# EAGLE design tiny84 (EAGLE 5.12)
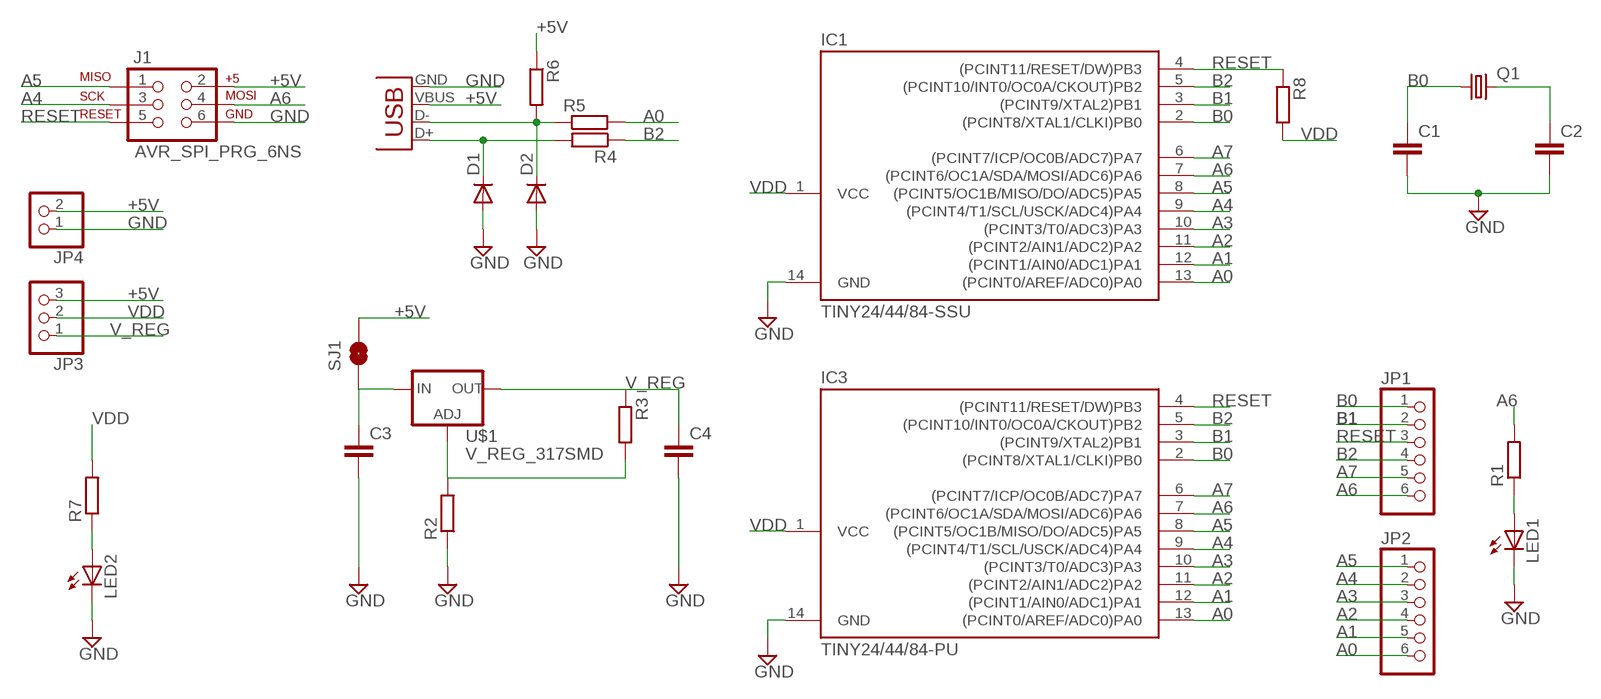
[diagram p0: schematic, sheet 1]

## Parts
C1  C-EU025-025X050  [C025-025X050]
C2  C-EU025-025X050  [C025-025X050]
C3  C-EUC0603  [C0603]
C4  C-EUC0603  [C0603]
D1  DIODE-MICROMELF-W  [MICROMELF-W]
D2  DIODE-MICROMELF-W  [MICROMELF-W]
IC1  TINY24/44/84-SSU  [SOIC14]
IC3  TINY24/44/84-PU  [DIL14]
J1  AVR_SPI_PRG_6NS  [2X3-NS]
JP1  PINHD-1X6  [1X06]
JP2  PINHD-1X6  [1X06]
JP3  PINHD-1X3  [1X03]
JP4  PINHD-1X2  [1X02]
LED1  LEDCHIP-LED0805  [CHIP-LED0805]
LED2  LEDCHIP-LED0805  [CHIP-LED0805]
Q1  CRYSTALHC49UV  [HC49U-V]
R1  R-EU_R0805  [R0805]
R2  R-EU_R0603  [R0603]
R3  R-EU_R0603  [R0603]
R4  R-EU_0204/5  [0204/5]
R5  R-EU_0204/5  [0204/5]
R6  R-EU_0204/5  [0204/5]
R7  R-EU_R0805  [R0805]
R8  R-EU_R0805  [R0805]
SJ1  SOLDERJUMPERNC  [SJ_2S]
U$1  V_REG_317SMD  [SOT223]
X1  USBOLD  [USB-MINIB-OLD]

## Nets
+5V: J1.2 JP3.3 JP4.2 R6.1 SJ1.2 X1.VBUS
A0: IC1.13((PCINT0/AREF/ADC0)PA0) IC3.13((PCINT0/AREF/ADC0)PA0) JP2.6 R5.2
A1: IC1.12((PCINT1/AIN0/ADC1)PA1) IC3.12((PCINT1/AIN0/ADC1)PA1) JP2.5
A2: IC1.11((PCINT2/AIN1/ADC2)PA2) IC3.11((PCINT2/AIN1/ADC2)PA2) JP2.4
A3: IC1.10((PCINT3/T0/ADC3)PA3) IC3.10((PCINT3/T0/ADC3)PA3) JP2.3
A4: IC1.9((PCINT4/T1/SCL/USCK/ADC4)PA4) IC3.9((PCINT4/T1/SCL/USCK/ADC4)PA4) J1.3 JP2.2
A5: IC1.8((PCINT5/OC1B/MISO/DO/ADC5)PA5) IC3.8((PCINT5/OC1B/MISO/DO/ADC5)PA5) J1.1 JP2.1
A6: IC1.7((PCINT6/OC1A/SDA/MOSI/ADC6)PA6) IC3.7((PCINT6/OC1A/SDA/MOSI/ADC6)PA6) J1.4 JP1.6 R1.2
A7: IC1.6((PCINT7/ICP/OC0B/ADC7)PA7) IC3.6((PCINT7/ICP/OC0B/ADC7)PA7) JP1.5
B0: C1.1 IC1.2((PCINT8/XTAL1/CLKI)PB0) IC3.2((PCINT8/XTAL1/CLKI)PB0) JP1.1 Q1.1
B1: C2.1 IC1.3((PCINT9/XTAL2)PB1) IC3.3((PCINT9/XTAL2)PB1) JP1.2 Q1.2
B2: IC1.5((PCINT10/INT0/OC0A/CKOUT)PB2) IC3.5((PCINT10/INT0/OC0A/CKOUT)PB2) JP1.4 R4.1
GND: C1.2 C2.2 C3.2 C4.2 D1.A D2.A IC1.14(GND) IC3.14(GND) J1.6 JP4.1 LED1.C LED2.C R2.1 X1.GND
N$1: LED1.A R1.1
N$2: D1.C R4.2 X1.D+
N$3: R2.2 R3.2 U$1.1(ADJ)
N$5: D2.C R5.1 R6.2 X1.D-
N$6: C3.1 SJ1.1 U$1.3(IN)
N$8: LED2.A R7.1
RESET: IC1.4((PCINT11/RESET/DW)PB3) IC3.4((PCINT11/RESET/DW)PB3) J1.5 JP1.3 R8.1
V_REG: C4.1 JP3.1 R3.1 U$1.2(OUT)
VDD: IC1.1(VCC) IC3.1(VCC) JP3.2 R7.2 R8.2

## Library data of the parts
C1-C4 = rcl:C-EU: CAPACITOR, European symbol
D1 D2 = diode:DIODE-: DIODE
IC1 IC3 = avr-6:TINY24/44/84
J1 = SparkFun_ihsan:AVR_SPI_PRG_6: AVR ISP 6 Pin This is the reduced ISP connector for AVR programming. Common on Arduino. This footprint will take up less PCB space and can be used with a 10-pin to 6-pin adapter such as SKU: BOB-08508
JP1 JP2 = pinhead:PINHD-1X6: PIN HEADER
JP3 = pinhead:PINHD-1X3: PIN HEADER
JP4 = pinhead:PINHD-1X2: PIN HEADER
LED1 LED2 = adafruit:LED: LED OSRAM: - CHIPLED LG R971, LG N971, LY N971, LG Q971, LY Q971, LO R971, LY R971 LH N974, LH R974 LS Q976, LO Q976, LY Q976 LO Q996 - Hyper CHIPLED LW Q18S LB Q993, LB Q99A, LB R99A - SideLED LS A670, LO A670, LY A670, LG A670, LP A670 LB A673, LV A673, LT A673, LW A673 LH A674 LY A675 LS A676, LA A676, LO A676, LY A676, LW A676 LS A679, LY A679, LG A679 - Hyper Micro SIDELED® LS Y876, LA Y876, LO Y876, LY Y876 LT Y87S - SmartLED LW L88C, LW L88S LB L89C, LB L89S, LG L890 LS L89K, LO L89K, LY L89K LS L896, LA L896, LO L896, LY L896 - TOPLED LS T670, LO T670, LY T670, LG T670, LP T670 LSG T670, LSP T670, LSY T670, LOP T670, LYG T670 LG T671, LOG T671, LSG T671 LB T673, LV T673, LT T673, LW T673 LH T674 LS T676, LA T676, LO T676, LY T676, LB T676, LH T676, LSB T676, LW T676 LB T67C, LV T67C, LT T67C, LS T67K, LO T67K, LY T67K, LW E67C LS E67B, LA E67B, LO E67B, LY E67B, LB E67C, LV E67C, LT E67C LW T67C LS T679, LY T679, LG T679 LS T770, LO T770, LY T770, LG T770, LP T770 LB T773, LV T773, LT T773, LW T773 LH T774 LS E675, LA E675, LY E675, LS T675 LS T776, LA T776, LO T776, LY T776, LB T776 LHGB T686 LT T68C, LB T68C - Hyper Mini TOPLED® LB M676 - Mini TOPLED Santana® LG M470 LS M47K, LO M47K, LY M47K Source: http://www.osram.convergy.de/
Q1 = SparkFun_ihsan:CRYSTAL: Crystals Various standard crystals. Proven footprints. Spark Fun Electronics SKU : COM-00534
R1-R8 = rcl:R-EU_: RESISTOR, European symbol
SJ1 = SparkFun_ihsan:SOLDERJUMPER: Solder Jumper Standard SMD solder jumper. Used to automate production. Two varients : Normally Open and Normally Closed are the same, but have different paste layers. NC will have a large amount of paste and should jumper during reflow.
U$1 = SparkFun_ihsan:V_REG_317: Voltage Regulator Standard LM317 adjustable voltage regulator. AOI (Adjust Output Input). Google 'LM317 Calculator' for easy to use app to get the two resistor values needed. 240/720 for 5V output. 240/390 for 3.3V output. Spark Fun Electronics SKU : COM-00527
X1 = SparkFun_ihsan:USB: USB Connectors USB-B-PTH is fully proven SKU : PRT-00139 USB-miniB is fully proven SKU : PRT-00587 USB-A-PCB is untested. USB-A-H is throughly reviewed, but untested. Spark Fun Electronics SKU : PRT-00437 USB-B-SMT is throughly reviewed, but untested. Needs silkscreen touching up. USB-A-S has not been used/tested USB-MB-H has not been used/tested

## Board
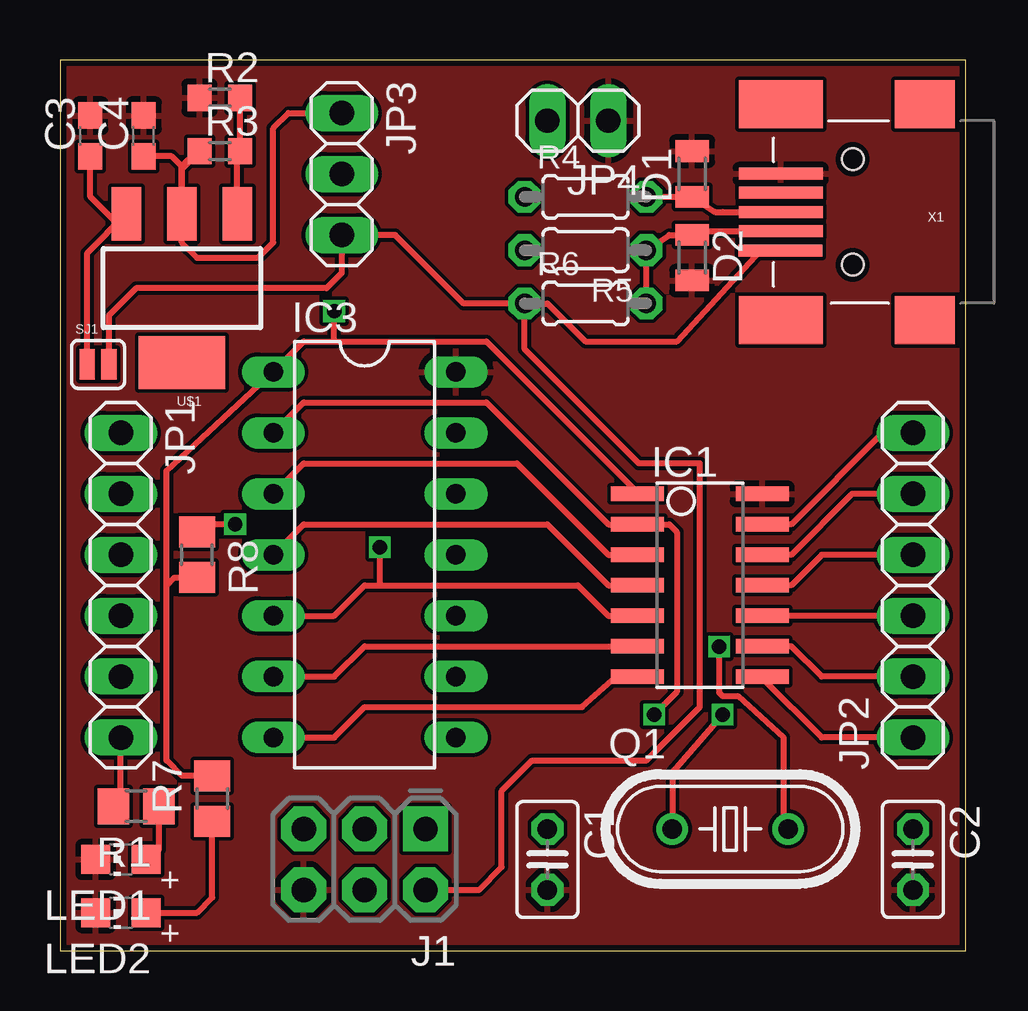
[diagram p1: board, top side]
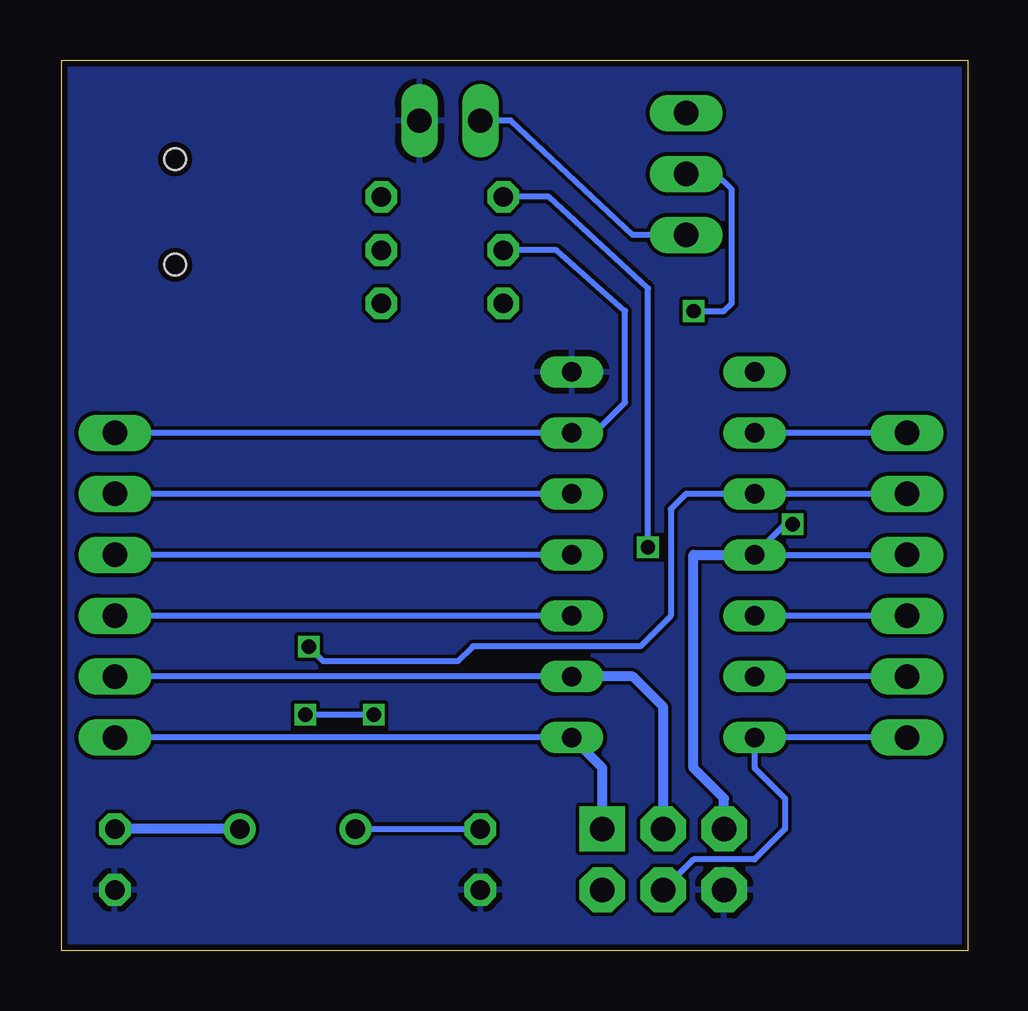
[diagram p2: board, bottom side, seen from below]

Size 37.77 x 37.14 mm. Coordinates in mm from the lower left corner, seen from the top.
Outline: 0,0 37.77,0 37.77,37.14 0,37.14 0,0
Copper layers (1*16): Top 0.035mm / dielectric 1.5mm / Bottom 0.035mm
Design rules "Fusion_eagle_rule_v1.1": minimum track width 6mil, minimum drill 12mil, track to track 6mil, track to pad 6mil, pad to pad 6mil, via to via 6mil, smd to smd 0mil, copper to edge 10mil, drill to drill 10mil, minimum pad ring 10mil, minimum via ring 6mil, stop-mask expansion 2mil, vias tented up to drill 100mil, thermal gap 10mil

### Footprints (pad centres in the part's own frame; a part is rotated, then mirrored left to right if it is on the bottom)
C025-025X050 = drill 0.813 octagon: 1 -1.27,0; 2 1.27,0
C0603 = smd 1.1 x 1: 1 -0.85,0; 2 0.85,0
MICROMELF-W = smd 0.9 x 1.4: A 0.95,0; C -0.95,0
SOIC14 = smd 0.61 x 2.21: 1 -3.81,-2.603; 2 -2.54,-2.603; 3 -1.27,-2.603; 4 0,-2.603; 5 1.27,-2.603; 6 2.54,-2.603; 7 3.81,-2.603; 8 3.81,2.603; 9 2.54,2.603; 10 1.27,2.603; 11 0,2.603; 12 -1.27,2.603; 13 -2.54,2.603; 14 -3.81,2.603
DIL14 = drill 0.813 long: 1 -7.62,-3.81; 2 -5.08,-3.81; 3 -2.54,-3.81; 4 0,-3.81; 5 2.54,-3.81; 6 5.08,-3.81; 7 7.62,-3.81; 8 7.62,3.81; 9 5.08,3.81; 10 2.54,3.81; 11 0,3.81; 12 -2.54,3.81; 13 -5.08,3.81; 14 -7.62,3.81
2X3-NS = drill 1.016 pad 1.88 square: 1 -2.54,-1.27 | drill 1.016 pad 1.88 octagon: 2 -2.54,1.27; 3 0,-1.27; 4 0,1.27; 5 2.54,-1.27; 6 2.54,1.27
1X06 = drill 1.016 long: 1 -6.35,0; 2 -3.81,0; 3 -1.27,0; 4 1.27,0; 5 3.81,0; 6 6.35,0
1X03 = drill 1.016 long: 1 -2.54,0; 2 0,0; 3 2.54,0
1X02 = drill 1.016 long: 1 -1.27,0; 2 1.27,0
CHIP-LED0805 = smd 1.2 x 1.2: A 0,-1.05; C 0,1.05
HC49U-V = drill 0.813 round: 1 -2.413,0; 2 2.413,0
R0805 = smd 1.3 x 1.5: 1 -0.95,0; 2 0.95,0
R0603 = smd 1 x 1.1: 1 -0.85,0; 2 0.85,0
0204/5 = drill 0.813 octagon: 1 -2.54,0; 2 2.54,0
SJ_2S = smd 0.635 x 1.27: 1 -0.45,0; 2 0.45,0
SOT223 = smd 1.219 x 2.235: 1 -2.311,-3.099; 2 0,-3.099; 3 2.311,-3.099 | smd 3.6 x 2.2: 4 0,3.099
USB-MINIB-OLD = smd 2.5 x 2: 1 -3,-4.5; 2 -3,4.5 | smd 3.5 x 2: 3 3,-4.5; 4 3,4.5 | smd 3.5 x 0.5: D+ 3,0; D- 3,0.8; GND 3,-1.6; ID 3,-0.8; VBUS 3.01,1.61 | hole 0.9: 0,2.2; 0,-2.2

### Placement (x,y rotation side)
C1  20.32,3.81 270 top
C2  35.56,3.81 270 top
C3  1.27,33.97 90 top
C4  3.49,33.97 90 top
D1  26.35,32.38 90 top
D2  26.35,28.89 270 top
IC1  26.67,15.24 270 top
IC3  12.7,16.51 270 top
J1  12.7,3.81 180 top
JP1  2.54,15.24 270 top
JP2  35.56,15.24 90 top
JP3  11.75,32.38 270 top
JP4  21.59,34.61 180 top
LED1  2.54,3.81 90 top
LED2  2.54,1.59 90 top
Q1  27.94,5.08 0 top
R1  3.17,6.03 180 top
R2  6.67,35.56 0 top
R3  6.67,33.34 0 top
R4  21.91,31.43 0 top
R5  21.91,29.21 180 top
R6  21.91,26.99 0 top
R7  6.35,6.35 90 top
R8  5.71,16.51 270 top
SJ1  1.59,24.45 0 top
U$1  5.08,27.62 180 top
X1  33.05,30.8 180 top

### Tracks (layer width: path | path; a pad name or v marks a point on that pad's centre or on a via)
+5V
  Top 0.254: J1.2 17.46,2.54 18.41,3.49 18.41,6.67 19.68,7.94 24.45,7.94 26.67,10.16 26.67,20.32 24.13,20.32 20,24.45 19.68,24.77 | R6.1 20.32,26.99 21.91,25.4 25.72,25.4 29.21,29.21 29.67,29.21 X1.VBUS | SJ1.2 2.04,26.48 3.17,27.62 11.11,27.62 11.75,28.26 JP3.3 13.97,29.84 16.83,26.99 R6.1 | 19.68,24.77 | 19.68,24.77 19.37,25.08 R6.1
  Bottom 0.254: JP3.3 13.97,29.84 19.05,34.61 JP4.2
A0
  Top 0.254: IC1.13 30.48,17.78 34.29,21.59 JP2.6
  Bottom 0.254: JP2.6 IC3.13 15.56,21.59 14.29,22.86 14.29,26.67 17.14,29.21 R5.2
A1
  Top 0.254: IC1.12 30.48,16.51 33.02,19.05 JP2.5
  Bottom 0.254: IC3.12 JP2.5
A2
  Top 0.254: IC1.11 30.48,15.24 31.75,16.51 JP2.4
  Bottom 0.254: IC3.11 JP2.4
A3
  Top 0.254: JP2.3 IC1.10
  Bottom 0.254: IC3.10 JP2.3
A4
  Top 0.254: IC1.9 30.48,12.7 31.75,11.43 JP2.2
  Bottom 0.254: IC3.9 JP2.2
  Bottom 0.406: J1.3 12.7,10.16 13.97,11.43 IC3.9
A5
  Top 0.254: IC1.8 29.27,11.37 31.75,8.89 JP2.1
  Bottom 0.254: IC3.8 JP2.1
  Bottom 0.406: J1.1 15.24,7.62 IC3.8
A6
  Top 0.254: 23.2,11.43 21.76,10.16 12.7,10.16 11.43,8.89 IC3.7 | JP1.6 2.54,6.35 R1.2
  Top 0.406: 23.2,11.43 IC1.7
  Bottom 0.254: J1.4 11.43,3.81 8.89,3.81 7.62,5.08 7.62,6.35 8.89,7.62 IC3.7 JP1.6
A7
  Top 0.254: IC1.6 12.7,12.7 11.43,11.43 IC3.6
  Bottom 0.254: JP1.5 IC3.6
B0  (via drill 0.6)
  Top 0.254: IC3.2 10.16,22.86 17.78,22.86 22.86,17.78 IC1.2 25.4,17.78 25.72,17.46 25.72,10.79 v24.77,9.84 | Q1.1 25.53,7.43 v27.62,9.84
  Bottom 0.254: JP1.1 IC3.2 | Q1.1 C1.1 | v24.77,9.84 v27.62,9.84
B1  (via drill 0.6)
  Top 0.254: IC1.3 22.86,16.51 19.05,20.32 10.16,20.32 IC3.3 | v27.48,12.68 27.48,10.77 27.62,10.62 28.26,10.62 30.16,8.89 30.16,5.27 Q1.2
  Bottom 0.254: JP1.2 IC3.3 11.75,19.05 12.38,18.41 12.38,13.97 13.65,12.7 20.64,12.7 21.27,12.06 26.87,12.06 v27.48,12.68
  Bottom 0.406: Q1.2 C2.1
B2  (via drill 0.6)
  Top 0.254: IC1.5 22.86,13.97 21.59,15.24 13.34,15.24 | 13.34,15.24 12.7,15.24 11.43,13.97 IC3.5 | 13.34,15.24 v13.34,16.83
  Bottom 0.254: JP1.4 IC3.5 | v13.34,16.83 13.34,27.62 17.46,31.43 R4.1
GND
  pour Bottom: -3.81,-3.81 43.18,-3.81 43.18,39.37 -3.81,39.37
  pour Top: -2.54,38.1 40.64,38.1 40.64,-2.54 -2.54,-2.54
N$1
  Top 0.254: 4.03,3.81 LED1.A 4.12,4.23 R1.1
N$2
  Top 0.254: X1.D+ 27.62,30.8 27.3,30.8 D1.C 26.03,31.43 R4.2
N$3
  Top 0.254: U$1.1 7.39,33.21 R3.2 R2.2
N$5
  Top 0.254: R6.2 R5.1 25.4,29.84 D2.C 26.83,30 X1.D-
N$6
  Top 0.254: C3.1 1.27,31.43 2.22,30.48 2.53,30.48 U$1.3 1.14,29.09 SJ1.1
N$8
  Top 0.254: LED2.A 5.71,1.59 6.35,2.22 R7.1
RESET  (via drill 0.6)
  Top 0.254: IC1.4 22.86,15.24 20.32,17.78 10.16,17.78 IC3.4 | R8.1 6.03,17.78 v7.3,17.78
  Bottom 0.254: JP1.3 IC3.4 7.62,17.78 v7.3,17.78
  Bottom 0.406: IC3.4 11.43,16.51 11.43,7.62 10.16,6.35 J1.5
V_REG
  Top 0.254: U$1.2 5.08,32.6 5.13,32.65 | 5.13,32.65 R3.1 5.71,33.34 5.08,32.7 5.08,29.53 5.71,28.89 8.26,28.89 8.89,29.53 8.89,34.29 9.53,34.92 JP3.1 | C4.1 4.66,33.12 5.13,32.65
VDD  (via drill 0.6)
  Top 0.254: 11.43,25.4 10.16,25.4 IC3.1 4.45,20 4.45,15.24 | 11.43,25.4 17.78,25.4 24.07,19.11 IC1.1 24.77,19.05 | R7.2 5.08,7.3 4.45,7.94 4.45,15.24 | 11.43,25.4 v11.43,26.67 | R8.2 4.76,15.56 4.45,15.24
  Bottom 0.254: JP3.2 10.48,32.38 9.84,31.75 9.84,26.99 10.16,26.67 v11.43,26.67

### Text on the board
_tsilk: V_REG | VDD? | 1.2k | 5V | 27 | LM317 | 27 | Reg enbl? | tiny84 | B0 | A0 | demo board | B1 | A1 | A2 | B2 | A3 | A7 | A4 | A6 | A5 | miso | USER | PWR | ihsan kehribar